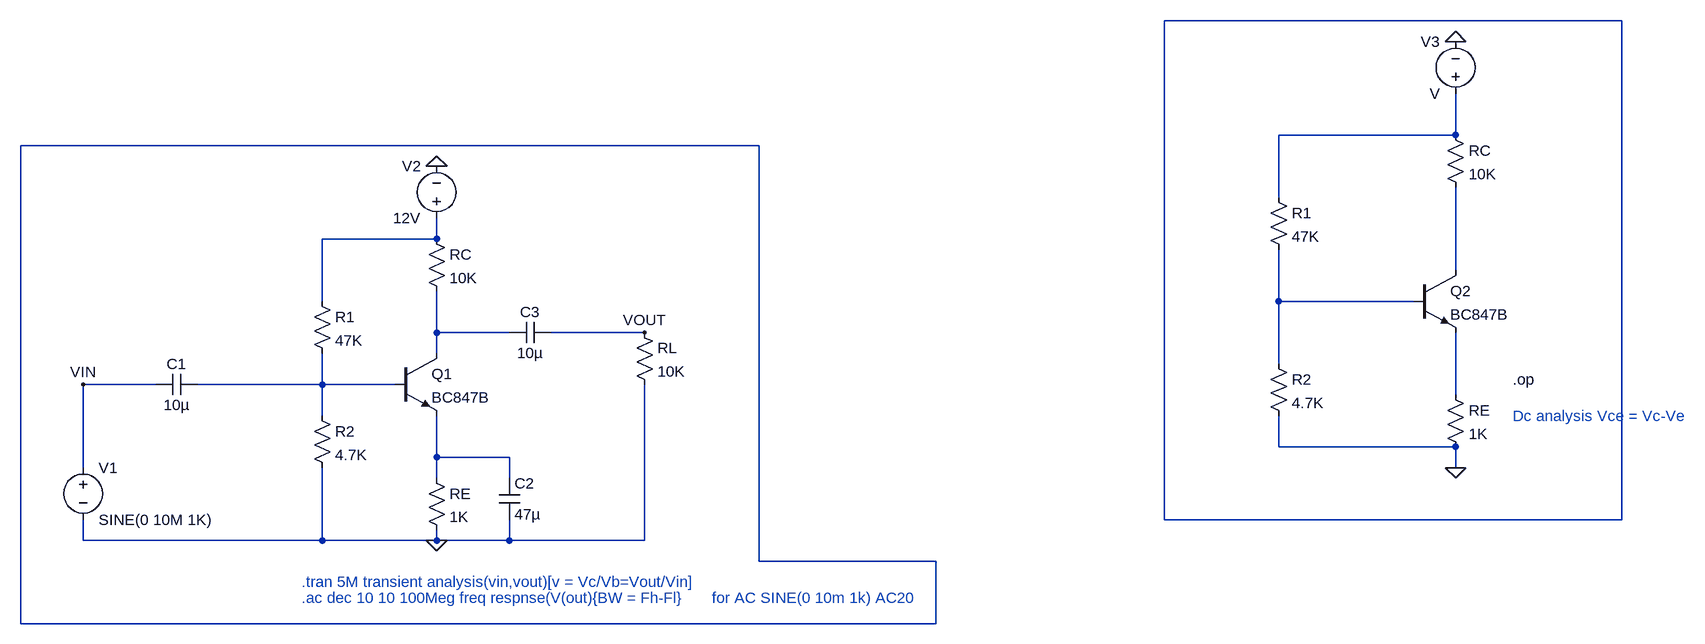
[diagram p0: schematic CE_Amp.asc]
CE_Amp.asc, the LTspice schematic file:
Version 4
SHEET 1 2224 680
WIRE 2112 -368 1408 -368
WIRE 1856 -192 1856 -256
WIRE 1856 -192 1584 -192
WIRE 784 -176 -352 -176
WIRE 1584 -96 1584 -192
WIRE 288 -32 288 -64
WIRE 288 -32 112 -32
WIRE 1856 16 1856 -112
WIRE 112 64 112 -32
WIRE 1584 64 1584 -16
WIRE 1792 64 1584 64
WIRE 288 112 288 48
WIRE 400 112 288 112
WIRE 608 112 464 112
WIRE 288 144 288 112
WIRE 1584 160 1584 64
WIRE -144 192 -256 192
WIRE 112 192 112 144
WIRE 112 192 -80 192
WIRE 224 192 112 192
WIRE 1856 208 1856 112
WIRE 112 240 112 192
WIRE 1584 288 1584 240
WIRE 1856 288 1584 288
WIRE 288 304 288 240
WIRE 400 304 288 304
WIRE -256 320 -256 192
WIRE 1856 320 1856 288
WIRE 288 336 288 304
WIRE 400 336 400 304
WIRE 1408 400 1408 -368
WIRE 2112 400 2112 -368
WIRE 2112 400 1408 400
WIRE -256 432 -256 400
WIRE 112 432 112 320
WIRE 112 432 -256 432
WIRE 288 432 288 416
WIRE 288 432 112 432
WIRE 400 432 400 400
WIRE 400 432 288 432
WIRE 608 432 608 192
WIRE 608 432 400 432
WIRE 784 464 784 -176
WIRE 1056 464 784 464
WIRE -352 560 -352 -176
WIRE 1056 560 1056 464
WIRE 1056 560 -352 560
FLAG 288 432 0
FLAG 288 -144 0
FLAG -256 192 VIN
FLAG 608 112 VOUT
FLAG 1856 -336 0
FLAG 1856 320 0
SYMBOL res 96 48 R0
SYMATTR InstName R1
SYMATTR Value 47K
SYMBOL res 96 224 R0
SYMATTR InstName R2
SYMATTR Value 4.7K
SYMBOL res 272 -48 R0
SYMATTR InstName RC
SYMATTR Value 10K
SYMBOL res 272 320 R0
SYMATTR InstName RE
SYMATTR Value 1K
SYMBOL cap 384 336 R0
SYMATTR InstName C2
SYMATTR Value 47µ
SYMBOL res 592 96 R0
SYMATTR InstName RL
SYMATTR Value 10K
SYMBOL npn 224 144 R0
SYMATTR InstName Q1
SYMATTR Value BC847B
SYMBOL cap 464 96 R90
WINDOW 0 0 32 VBottom 2
WINDOW 3 32 32 VTop 2
SYMATTR InstName C3
SYMATTR Value 10µ
SYMBOL voltage 288 -48 R180
WINDOW 0 24 96 Left 2
WINDOW 3 24 16 Left 2
SYMATTR InstName V2
SYMATTR Value 12V
SYMBOL cap -80 176 R90
WINDOW 0 0 32 VBottom 2
WINDOW 3 32 32 VTop 2
SYMATTR InstName C1
SYMATTR Value 10µ
SYMBOL voltage -256 304 R0
WINDOW 123 24 124 Left 2
WINDOW 39 0 0 Left 0
SYMATTR InstName V1
SYMATTR Value SINE(0 10M 1K)
SYMBOL res 1568 -112 R0
SYMATTR InstName R1
SYMATTR Value 47K
SYMBOL res 1568 144 R0
SYMATTR InstName R2
SYMATTR Value 4.7K
SYMBOL res 1840 -208 R0
SYMATTR InstName RC
SYMATTR Value 10K
SYMBOL res 1840 192 R0
SYMATTR InstName RE
SYMATTR Value 1K
SYMBOL npn 1792 16 R0
SYMATTR InstName Q2
SYMATTR Value BC847B
SYMBOL voltage 1856 -240 R180
WINDOW 0 24 96 Left 2
WINDOW 3 24 16 Left 2
SYMATTR InstName V3
TEXT 80 496 Left 2 ;.tran 5M transient analysis(vin,vout)[v = Vc/Vb=Vout/Vin]
TEXT 712 520 Left 2 ;for AC SINE(0 10m 1k) AC20
TEXT 80 520 Left 2 ;.ac dec 10 10 100Meg freq respnse(V(out){BW = Fh-Fl}
TEXT 1944 184 Left 2 !.op
TEXT 1944 240 Left 2 ;Dc analysis Vce = Vc-Ve

The netlist it stands for:
* CE_Amp.asc
R1 N004 N008 47K
R2 N008 0 4.7K
RC N004 N007 10K
RE N010 0 1K
C2 N010 0 47µ
RL VOUT 0 10K
Q1 N007 N008 N010 0 BC847B
C3 VOUT N007 10µ
V2 N004 0 12V
C1 N008 VIN 10µ
V1 VIN 0 SINE(0 10M 1K)
R1 N002 N006 47K
R2 N006 0 4.7K
RC N002 N005 10K
RE N009 0 1K
Q2 N005 N006 N009 0 BC847B
V3 N002 0 V
.model NPN NPN
.model PNP PNP
.lib standard.bjt
* .tran 5M transient analysis(vin,vout)[v = Vc/Vb=Vout/Vin]
* for AC SINE(0 10m 1k) AC20
* .ac dec 10 10 100Meg freq respnse(V(out){BW = Fh-Fl}
.op
* Dc analysis Vce = Vc-Ve
.backanno
.end